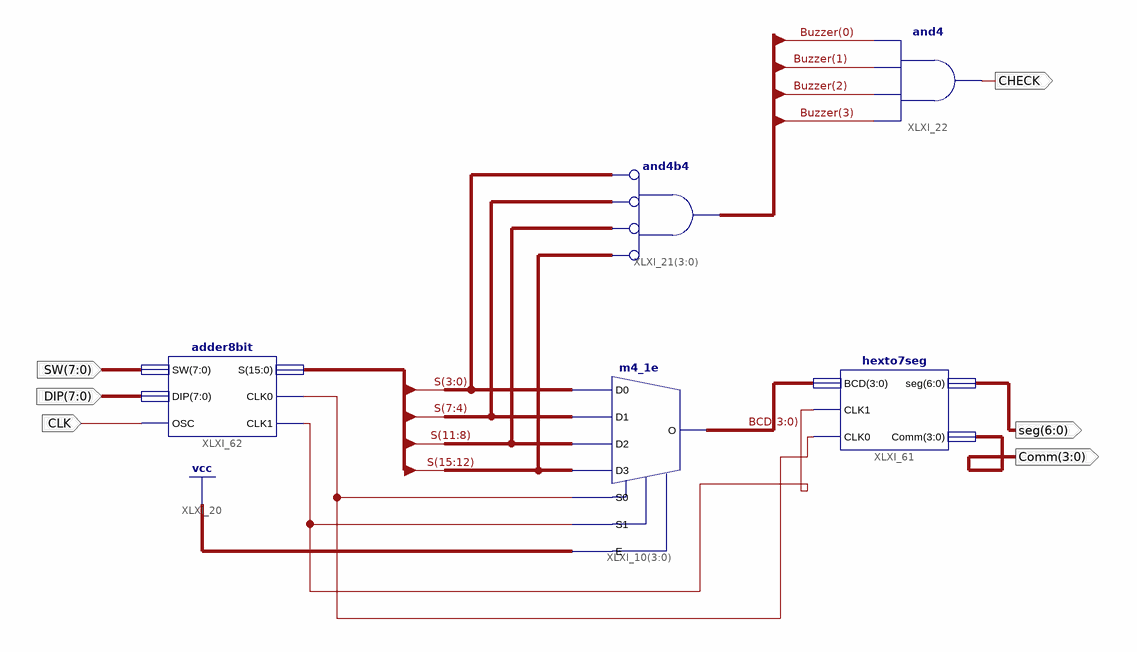
[diagram p0: schematic sheet 1]
// Xilinx ISE schematic main.sch (spartan6) as structural Verilog: 5 symbols, 6 ports
module main (
  input  [7:0] SW,
  input  [7:0] DIP,
  input  CLK,
  output [3:0] Comm,
  output CHECK,
  output [6:0] seg
);

  wire XLXN_30, XLXN_52;
  wire [3:0] BCD, Buzzer;
  wire [15:0] S;

  m4_1e XLXI_10[3:0] (
    .D0(S[3:0]), .D1(S[7:4]), .D2(S[11:8]), .D3(S[15:12]), .E(4'b1111), .S0(XLXN_52), .S1(XLXN_30), .O(BCD));
  assign Buzzer = ~S[15:12] & ~S[11:8] & ~S[7:4] & ~S[3:0];  // and4b4 XLXI_21[3..0], 4 bits wide
  and XLXI_22 (CHECK, Buzzer[3], Buzzer[2], Buzzer[1], Buzzer[0]);
  hexto7seg XLXI_61 (.BCD(BCD), .CLK1(XLXN_30), .CLK0(XLXN_52), .seg(seg), .Comm(Comm));
  adder8bit XLXI_62 (.SW(SW), .DIP(DIP), .OSC(CLK), .S(S), .CLK0(XLXN_52), .CLK1(XLXN_30));

  // Notes on the sheet:
  //   LOC on signal SW(7:0) = P55,P56,P57,P58,P59,P61,P62,P66
  //   LOC on signal DIP(7:0) = P112,P111,P105,P104,P102,P101,P100,P99
  //   LOC on signal CLK = P123
  //   LOC on signal Comm(3:0) = P30,P33,P43,P44
  //   LOC on signal CHECK = P83
  //   LOC on signal seg(6:0) = P27,P29,P32,P34,P35,P40,P41
endmodule
